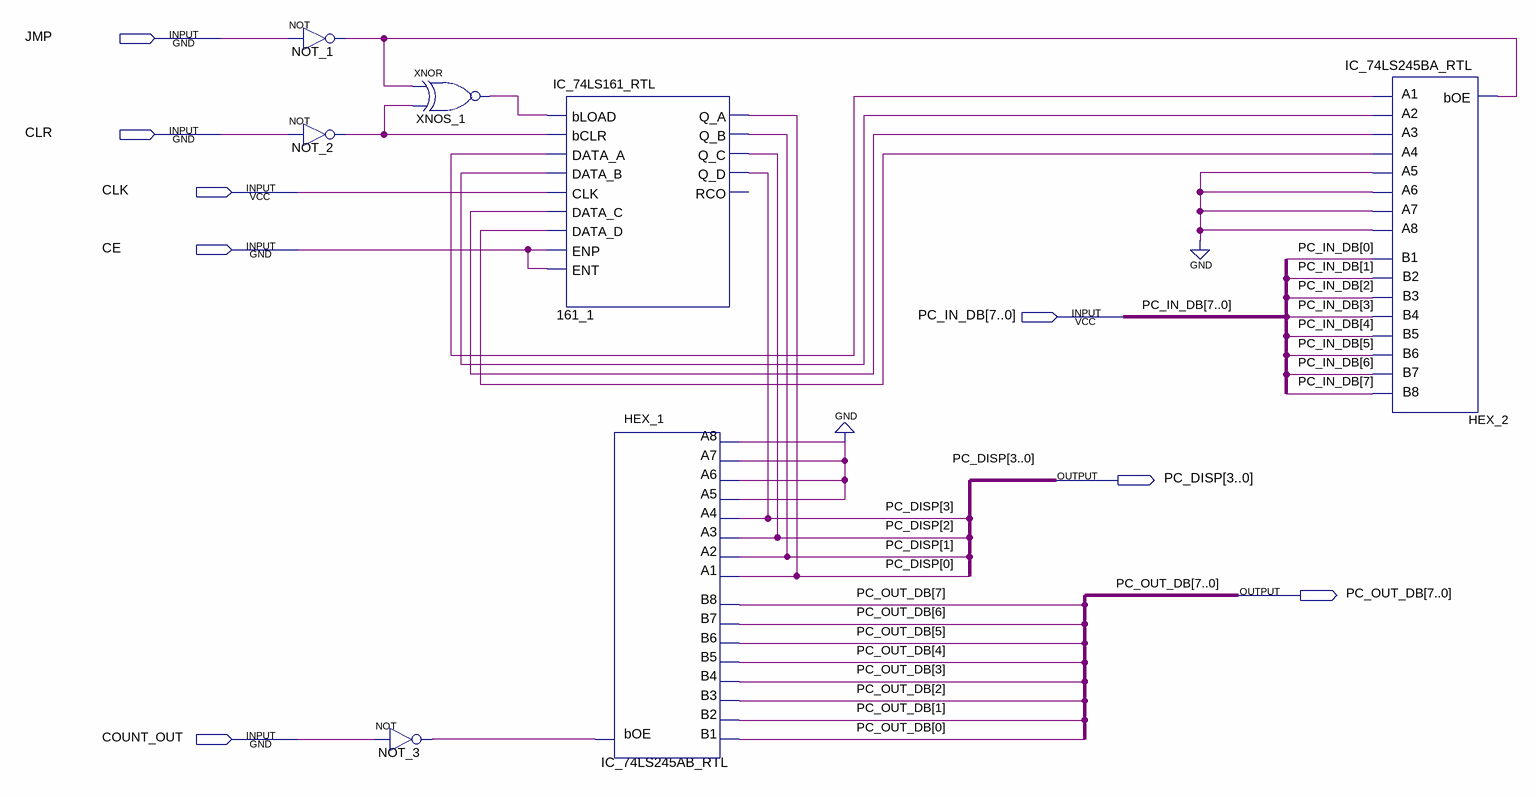
[diagram p0: schematic sheet]
// Quartus schematic Program_Counter.bdf as structural Verilog: 7 symbols, 8 pins
module Program_Counter (
  input  JMP,
  input  CLR,
  input  CLK,
  input  CE,
  input  [7:0] PC_IN_DB,
  input  COUNT_OUT,
  output [3:0] PC_DISP,
  output [7:0] PC_OUT_DB
);

  wire HEX_2_a1, HEX_2_a2, HEX_2_a3, HEX_2_a4, HEX_2_a5, NOT_1_out, NOT_2_out, NOT_3_out, XNOS_1_out;

  not NOT_1 (NOT_1_out, JMP);
  not NOT_2 (NOT_2_out, CLR);
  not NOT_3 (NOT_3_out, COUNT_OUT);
  xnor XNOS_1 (XNOS_1_out, NOT_1_out, NOT_2_out);
  IC_74LS161_RTL u_161_1 (
    .bLOAD(XNOS_1_out), .bCLR(NOT_2_out), .DATA_A(HEX_2_a1), .DATA_B(HEX_2_a2), .CLK(CLK), .DATA_C(HEX_2_a3),
    .DATA_D(HEX_2_a4), .ENP(CE), .ENT(CE), .Q_A(PC_DISP[0]), .Q_B(PC_DISP[1]), .Q_C(PC_DISP[2]),
    .Q_D(PC_DISP[3]));  // open: RCO
  IC_74LS245AB_RTL HEX_1 (
    .bOE(NOT_3_out), .A1(PC_DISP[0]), .A2(PC_DISP[1]), .A3(PC_DISP[2]), .A4(PC_DISP[3]), .A5(1'b0),
    .A6(1'b0), .A7(1'b0), .A8(1'b0), .B1(PC_OUT_DB[0]), .B2(PC_OUT_DB[1]), .B3(PC_OUT_DB[2]),
    .B4(PC_OUT_DB[3]), .B5(PC_OUT_DB[4]), .B6(PC_OUT_DB[5]), .B7(PC_OUT_DB[6]), .B8(PC_OUT_DB[7]));
  IC_74LS245BA_RTL HEX_2 (
    .bOE(NOT_1_out), .B1(PC_IN_DB[0]), .B2(PC_IN_DB[1]), .B3(PC_IN_DB[2]), .B4(PC_IN_DB[3]),
    .B5(PC_IN_DB[4]), .B6(PC_IN_DB[5]), .B7(PC_IN_DB[6]), .B8(PC_IN_DB[7]), .A1(HEX_2_a1), .A2(HEX_2_a2),
    .A3(HEX_2_a3), .A4(HEX_2_a4), .A5(HEX_2_a5), .A6(HEX_2_a5), .A7(HEX_2_a5), .A8(HEX_2_a5));
  // also tied to GND on the sheet: HEX_2_a5
endmodule
